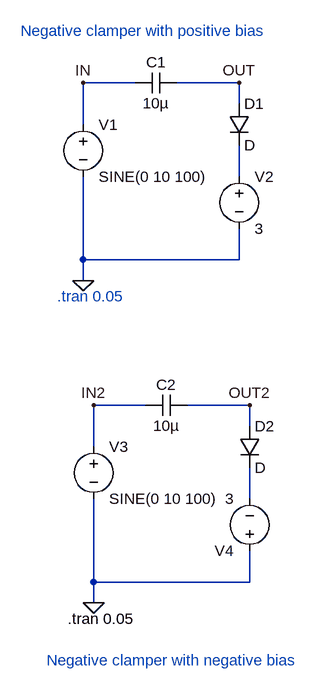
[diagram p0: schematic Negative_clamper_with_bias.asc]
Negative_clamper_with_bias.asc, the LTspice schematic file:
Version 4.1
SHEET 1 880 952
WIRE 192 48 112 48
WIRE 352 48 256 48
WIRE 352 80 352 48
WIRE 112 112 112 48
WIRE 352 192 352 144
WIRE 112 320 112 192
WIRE 352 320 352 272
WIRE 352 320 112 320
WIRE 112 352 112 320
WIRE 208 544 128 544
WIRE 368 544 272 544
WIRE 368 576 368 544
WIRE 128 608 128 544
WIRE 368 688 368 640
WIRE 128 816 128 688
WIRE 368 816 368 768
WIRE 368 816 128 816
WIRE 128 848 128 816
FLAG 112 352 0
FLAG 112 48 IN
FLAG 352 48 OUT
FLAG 128 848 0
FLAG 128 544 IN2
FLAG 368 544 OUT2
SYMBOL voltage 112 96 R0
WINDOW 123 0 0 Left 0
WINDOW 39 0 0 Left 0
SYMATTR InstName V1
SYMATTR Value SINE(0 10 100)
SYMBOL cap 256 32 R90
WINDOW 0 0 32 VBottom 2
WINDOW 3 32 32 VTop 2
SYMATTR InstName C1
SYMATTR Value 10µ
SYMBOL diode 336 80 R0
SYMATTR InstName D1
SYMBOL voltage 352 176 R0
WINDOW 123 0 0 Left 0
WINDOW 39 0 0 Left 0
SYMATTR InstName V2
SYMATTR Value 3
SYMBOL voltage 128 592 R0
WINDOW 123 0 0 Left 0
WINDOW 39 0 0 Left 0
SYMATTR InstName V3
SYMATTR Value SINE(0 10 100)
SYMBOL cap 272 528 R90
WINDOW 0 0 32 VBottom 2
WINDOW 3 32 32 VTop 2
SYMATTR InstName C2
SYMATTR Value 10µ
SYMBOL diode 352 576 R0
SYMATTR InstName D2
SYMBOL voltage 368 784 R180
WINDOW 123 0 0 Left 0
WINDOW 39 0 0 Left 0
SYMATTR InstName V4
SYMATTR Value 3
TEXT 72 376 Left 2 ;.tran 0.05
TEXT 88 872 Left 2 !.tran 0.05
TEXT 16 -32 Left 2 ;Negative clamper with positive bias
TEXT 56 936 Left 2 ;Negative clamper with negative bias

The netlist it stands for:
* Negative_clamper_with_bias.asc
V1 IN 0 SINE(0 10 100)
C1 OUT IN 10µ
D1 OUT N001 D
V2 N001 0 3
V3 IN2 0 SINE(0 10 100)
C2 OUT2 IN2 10µ
D2 OUT2 N002 D
V4 0 N002 3
.model D D
.lib standard.dio
* .tran 0.05
.tran 0.05
* Negative clamper with positive bias
* Negative clamper with negative bias
.backanno
.end

* Results of the author's LTspice run, read from the files saved beside the schematic
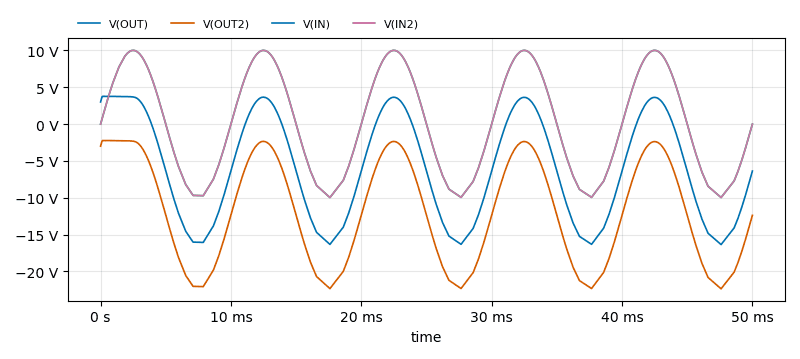
[diagram p1: Transient Analysis of Negative_clamper_with_bias.asc, plotted from the saved traces]
* Transient Analysis, 1 run:
*   V(OUT): min -16.35 V, max 3.771 V, average -6.117 V, rms 9.445 V, last -6.38 V
*   V(OUT2): min -22.35 V, max -2.229 V, average -12.12 V, rms 14.09 V, last -12.38 V
*   V(IN): min -9.973 V, max 10 V, average 58.73 mV, rms 7.017 V, last 0 V
*   V(IN2): min -9.973 V, max 10 V, average 58.73 mV, rms 7.017 V, last 0 V